# Altium schematic sheet SoporokoHost.SchDoc
size A0
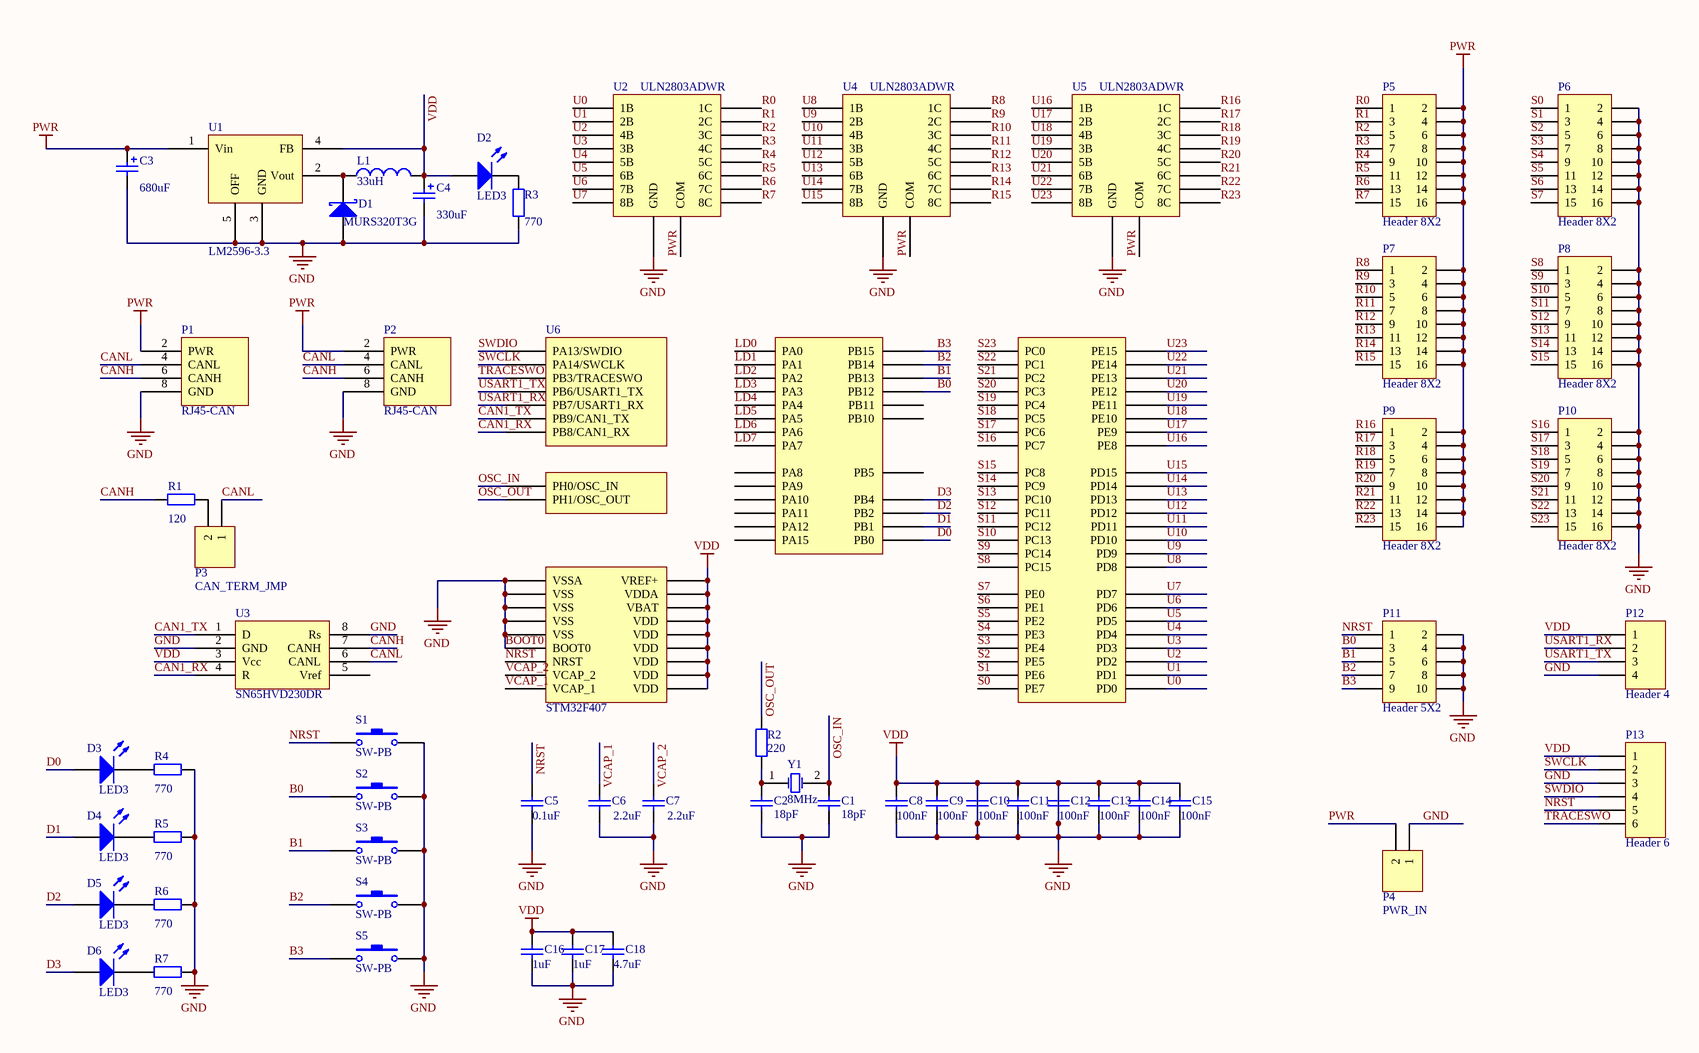
[diagram p0: SoporokoHost.SchDoc]

## Parts
C1  value 18pF  [0805_C]  (hidden comment: Cap)
C2  value 18pF  [0805_C]  (hidden comment: Cap)
C3  value 680uF  [CAP-H13]  (hidden comment: Cap Pol2)
C4  value 330uF  [CAPMP7343X43N]  (hidden comment: Cap Pol2)
C5  value 0.1uF  [6-0805_N]  (hidden comment: Cap)
C6  value 2.2uF  [6-0805_N]  (hidden comment: Cap)
C7  value 2.2uF  [6-0805_N]  (hidden comment: Cap)
C8  value 100nF  [6-0805_N]  (hidden comment: Cap)
C9  value 100nF  [6-0805_N]  (hidden comment: Cap)
C10  value 100nF  [6-0805_N]  (hidden comment: Cap)
C11  value 100nF  [6-0805_N]  (hidden comment: Cap)
C12  value 100nF  [6-0805_N]  (hidden comment: Cap)
C13  value 100nF  [6-0805_N]  (hidden comment: Cap)
C14  value 100nF  [6-0805_N]  (hidden comment: Cap)
C15  value 100nF  [6-0805_N]  (hidden comment: Cap)
C16  value 1uF  [6-0805_N]  (hidden comment: Cap)
C17  value 1uF  [6-0805_N]  (hidden comment: Cap)
C18  value 4.7uF  [6-0805_N]  (hidden comment: Cap)
D1  MURS320T3G  [DIODE_CASE403]
D2  LED3  [6-0805_N]
D3  LED3  [6-0805_N]
D4  LED3  [6-0805_N]
D5  LED3  [6-0805_N]
D6  LED3  [6-0805_N]
L1  value 33uH  [INDP125125X80N]  (hidden comment: Inductor)
P1  RJ45-CAN  [RJ45-CAN]
P2  RJ45-CAN  [RJ45-CAN]
P3  CAN_TERM_JMP  [HDR1X2]
P4  PWR_IN  [HDR1X2]
P5  Header 8X2  [HDR2X8]
P6  Header 8X2  [HDR2X8]
P7  Header 8X2  [HDR2X8]
P8  Header 8X2  [HDR2X8]
P9  Header 8X2  [HDR2X8]
P10  Header 8X2  [HDR2X8]
P11  Header 5X2  [HDR2X5]
P12  Header 4  [HDR1X4]
P13  Header 6  [HDR1X6]
R1  value 120  [RESC5025M]  (hidden comment: Res)
R2  value 220  [0805_R]  (hidden comment: Res2)
R3  value 770  [6-0805_N]  (hidden comment: Res2)
R4  value 770  [6-0805_N]  (hidden comment: Res2)
R5  value 770  [6-0805_N]  (hidden comment: Res2)
R6  value 770  [6-0805_N]  (hidden comment: Res2)
R7  value 770  [6-0805_N]  (hidden comment: Res2)
S1  SW-PB  [SPST-2]
S2  SW-PB  [SPST-2]
S3  SW-PB  [SPST-2]
S4  SW-PB  [SPST-2]
S5  SW-PB  [SPST-2]
U1  LM2596-3.3  [DPAK170P1435X465-6N]
U2  ULN2803ADWR  [SOIC127P1030X265-18N]
U3  SN65HVD230DR  [SOIC127P600X175-8N]
U4  ULN2803ADWR  [SOIC127P1030X265-18N]
U5  ULN2803ADWR  [SOIC127P1030X265-18N]
U6  STM32F407  [TSQFP50P1600X1600X160-100N]
Y1  8MHz  [HC-49U]

## Nets
2: P1.1(PWR) P2.1(PWR)
3: U1.6(GND)
4: P1.3(CANL) P2.3(CANL)
6: P1.5(CANH) P2.5(CANH)
8: P1.7(GND) P1.9(GND) P2.7(GND) P2.9(GND)
BOOT0: C1.2 C2.1 C3.2 C4.1 C4.2 C5.1 C6.1 C7.1 C8.1 C8.2 C9.1 C9.2 C10.1 C10.2 C11.1 C11.2 C12.1 C12.2 C13.1 C13.2 C14.1 C14.2 C15.1 C15.2 C16.1 C16.2 C17.1 C17.2 C18.1 C18.2 D1.1(A) D2.1(A) L1.2 P1.8(GND) P2.8(GND) P4.1 P6.2 P6.4 P6.6 P6.8 P6.10 P6.12 P6.14 P6.16 P8.2 P8.4 P8.6 P8.8 P8.10 P8.12 P8.14 P8.16 P10.2 P10.4 P10.6 P10.8 P10.10 P10.12 P10.14 P10.16 P11.2 P11.4 P11.6 P11.8 P11.10 P12.1 P12.4 P13.1 P13.3 R3.1 R4.2 R5.2 R6.2 R7.2 S1.2 S2.2 S3.2 S4.2 S5.2 U1.3(GND) U1.4(FB) U1.5(OFF) U2.9(GND) U3.2(GND) U3.3(Vcc) U3.8(Rs) U4.9(GND) U5.9(GND) U6.6(VBAT) U6.10(VSS) U6.11(VDD) U6.19(VDD) U6.20(VSSA) U6.21(VREF+) U6.22(VDDA) U6.27(VSS) U6.28(VDD) U6.50(VDD) U6.74(VSS) U6.75(VDD) U6.94(BOOT0) U6.99(VSS) U6.100(VDD)  [also labelled GND, VDD]
PWR: C3.1 P1.2(PWR) P2.2(PWR) P4.2 P5.2 P5.4 P5.6 P5.8 P5.10 P5.12 P5.14 P5.16 P7.2 P7.4 P7.6 P7.8 P7.10 P7.12 P7.14 P7.16 P9.2 P9.4 P9.6 P9.8 P9.10 P9.12 P9.14 P9.16 U1.1(Vin) U2.10(COM) U4.10(COM) U5.10(COM)
B0: P11.3 S2.1 U6.51(PB12)
B1: P11.5 S3.1 U6.52(PB13)
B2: P11.7 S4.1 U6.53(PB14)
B3: P11.9 S5.1 U6.54(PB15)
CAN1_RX: U3.4(R) U6.95(PB8/CAN1_RX)
CAN1_TX: U3.1(D) U6.96(PB9/CAN1_TX)
CANH: P1.6(CANH) P2.6(CANH) R1.1 U3.7(CANH)
CANL: P1.4(CANL) P2.4(CANL) P3.1 U3.6(CANL)
D0: D3.1(A) U6.35(PB0)
D1: D4.1(A) U6.36(PB1)
D2: D5.1(A) U6.37(PB2)
D3: D6.1(A) U6.90(PB4)
LD0: U6.23(PA0)
LD1: U6.24(PA1)
LD2: U6.25(PA2)
LD3: U6.26(PA3)
LD4: U6.29(PA4)
LD5: U6.30(PA5)
LD6: U6.31(PA6)
LD7: U6.32(PA7)
NRST: C5.2 P11.1 P13.5 S1.1 U6.14(NRST)
OSC_IN: C1.1 U6.12(PH0/OSC_IN) Y1.2(OSC2)
OSC_OUT: R2.1 U6.13(PH1/OSC_OUT)
R0: P5.1 U2.18(1C)
R1: P5.3 U2.17(2C)
R2: P5.5 U2.16(3C)
R3: P5.7 U2.15(4C)
R4: P5.9 U2.14(5C)
R5: P5.11 U2.13(6C)
R6: P5.13 U2.12(7C)
R7: P5.15 U2.11(8C)
R8: P7.1 U4.18(1C)
R9: P7.3 U4.17(2C)
R10: P7.5 U4.16(3C)
R11: P7.7 U4.15(4C)
R12: P7.9 U4.14(5C)
R13: P7.11 U4.13(6C)
R14: P7.13 U4.12(7C)
R15: P7.15 U4.11(8C)
R16: P9.1 U5.18(1C)
R17: P9.3 U5.17(2C)
R18: P9.5 U5.16(3C)
R19: P9.7 U5.15(4C)
R20: P9.9 U5.14(5C)
R21: P9.11 U5.13(6C)
R22: P9.13 U5.12(7C)
R23: P9.15 U5.11(8C)
S0: P6.1 U6.38(PE7)
S1: P6.3 U6.5(PE6)
S2: P6.5 U6.4(PE5)
S3: P6.7 U6.3(PE4)
S4: P6.9 U6.2(PE3)
S5: P6.11 U6.1(PE2)
S6: P6.13 U6.98(PE1)
S7: P6.15 U6.97(PE0)
S8: P8.1 U6.9(PC15)
S9: P8.3 U6.8(PC14)
S10: P8.5 U6.7(PC13)
S11: P8.7 U6.80(PC12)
S12: P8.9 U6.79(PC11)
S13: P8.11 U6.78(PC10)
S14: P8.13 U6.66(PC9)
S15: P8.15 U6.65(PC8)
S16: P10.1 U6.64(PC7)
S17: P10.3 U6.63(PC6)
S18: P10.5 U6.34(PC5)
S19: P10.7 U6.33(PC4)
S20: P10.9 U6.18(PC3)
S21: P10.11 U6.17(PC2)
S22: P10.13 U6.16(PC1)
S23: P10.15 U6.15(PC0)
SWCLK: P13.2 U6.76(PA14/SWCLK)
SWDIO: P13.4 U6.72(PA13/SWDIO)
TRACESWO: P13.6 U6.89(PB3/TRACESWO)
U0: U2.1(1B) U6.81(PD0)
U1: U2.2(2B) U6.82(PD1)
U2: U2.4(4B) U6.83(PD2)
U3: U2.3(3B) U6.84(PD3)
U4: U2.5(5B) U6.85(PD4)
U5: U2.6(6B) U6.86(PD5)
U6: U2.7(7B) U6.87(PD6)
U7: U2.8(8B) U6.88(PD7)
U8: U4.1(1B) U6.55(PD8)
U9: U4.2(2B) U6.56(PD9)
U10: U4.4(4B) U6.57(PD10)
U11: U4.3(3B) U6.58(PD11)
U12: U4.5(5B) U6.59(PD12)
U13: U4.6(6B) U6.60(PD13)
U14: U4.7(7B) U6.61(PD14)
U15: U4.8(8B) U6.62(PD15)
U16: U5.1(1B) U6.39(PE8)
U17: U5.2(2B) U6.40(PE9)
U18: U5.4(4B) U6.41(PE10)
U19: U5.3(3B) U6.42(PE11)
U20: U5.5(5B) U6.43(PE12)
U21: U5.6(6B) U6.44(PE13)
U22: U5.7(7B) U6.45(PE14)
U23: U5.8(8B) U6.46(PE15)
USART1_RX: P12.2 U6.93(PB7/USART1_RX)
USART1_TX: P12.3 U6.92(PB6/USART1_TX)
VCAP_1: C6.2 U6.49(VCAP_1)
VCAP_2: C7.2 U6.73(VCAP_2)
NetC2_2: C2.2 R2.2 Y1.1(OSC1)
NetD1_2: D1.2(K) L1.1 U1.2(Vout)
NetD2_2: D2.2(K) R3.2
NetD3_2: D3.2(K) R4.1
NetD4_2: D4.2(K) R5.1
NetD5_2: D5.2(K) R6.1
NetD6_2: D6.2(K) R7.1
NetP3_2: P3.2 R1.2

Not connected (* = marked no-connect by the designer): U3 5(Vref); U6 47(PB10) 48(PB11) 67(PA8) 68(PA9) 69(PA10) 70(PA11) 71(PA12) 77(PA15) 91(PB5)

## Notes on the sheet
- Title
- Size:
- Date:
- File:
- A0
- Number:
- Time:
- Revision:
- Sheet
- of

## Library data of the parts
C1 C2 C5-C18 = Cap: Capacitor; Published: 8-Jun-2000; LatestRevisionDate: 17-Jul-2002; LatestRevisionNote: Re-released for DXP Platform.; PackageReference: RAD-0.3; Publisher: Altium Limited; PackageDescription: Radial Cap, Thru-Hole; 2 Leads; 0.3 in Pin Spacing
C3 C4 = Cap Pol2: Polarized Capacitor (Axial); Published: 8-Jun-2000; LatestRevisionDate: 17-Jul-2002; LatestRevisionNote: Re-released for DXP Platform.; PackageReference: POLAR0.8; Publisher: Altium Limited; PackageDescription: Polarized Capacitor; 2 Leads
D1 = D Schottky: Published: 8-Jun-2000; LatestRevisionDate: 17-Jul-2002; LatestRevisionNote: Re-released for DXP Platform.; PackageReference: SMB; Publisher: Altium Limited; PackageDescription: DO-214-AA/SMB; 2 C-Bend Leads; Body 5.3 x 3.6 mm, inc. leads (LxW); Code_JEDEC: DO-214-AA
D2-D6 = LED3: Typical BLUE SiC LED; Published: 8-Jun-2000; LatestRevisionDate: 17-Dec-2003; LatestRevisionNote: PCB Footprint replaced.; DatasheetVersion: 16-Apr-2002; PackageVersion: 16-Apr-2002; PackageReference: 3.5X2.8X1.9; Publisher: Altium Limited; PackageDescription: SM LED; 2 C-Bend Leads; Body 3.5 x 2.8 x 1.9 mm, inc leads (LxWxH typ)
L1 = Inductor: Code_IEC: 1005; Published: 8-Jun-2000; LatestRevisionDate: 29-May-2009; LatestRevisionNote: IPC-7351 Footprint Added.; PackageReference: 0402-A; Publisher: Altium Limited; PackageDescription: Chip Inductor; Code_JEITA: 0402
P3 P4 = Header 2: Header, 2-Pin; LatestRevisionDate: 17-Jul-2002; LatestRevisionNote: Re-released for DXP Platform.; Publisher: Altium Limited
P5-P10 = Header 8X2: Header, 8-Pin, Dual row; LatestRevisionDate: 17-Jul-2002; LatestRevisionNote: Re-released for DXP Platform.; Publisher: Altium Limited
P11 = Header 5X2: Header, 5-Pin, Dual row; LatestRevisionDate: 17-Jul-2002; LatestRevisionNote: Re-released for DXP Platform.; Publisher: Altium Limited
P12 = Header 4: Header, 4-Pin; LatestRevisionDate: 17-Jul-2002; LatestRevisionNote: Re-released for DXP Platform.; Publisher: Altium Limited
P13 = Header 6: Header, 6-Pin; LatestRevisionDate: 17-Jul-2002; LatestRevisionNote: Re-released for DXP Platform.; Publisher: Altium Limited
R1-R7 = Res2: Resistor; Published: 8-Jun-2000; LatestRevisionDate: 17-Jul-2002; LatestRevisionNote: Re-released for DXP Platform.; PackageReference: AXIAL-0.4; Publisher: Altium Limited; PackageDescription: Axial Device, Thru-Hole; 2 Leads; 0.4 in Pin Spacing
S1-S5 = SW-PB: Switch; Published: 24-Mar-1999; LatestRevisionDate: 17-Jul-2002; LatestRevisionNote: Re-released for DXP Platform.; PackageReference: SPST-2; Publisher: Altium Limited; PackageDescription: Switch; 2 Leads
Y1 = XTAL: Crystal Oscillator; Published: 8-Jun-2000; LatestRevisionDate: 17-Jul-2002; LatestRevisionNote: Re-released for DXP Platform.; PackageReference: R38; Publisher: Altium Limited; PackageDescription: Crystal, Thru-Hole; 2 Leads; Body 3.1 x 8.2 mm (Dia.xH)